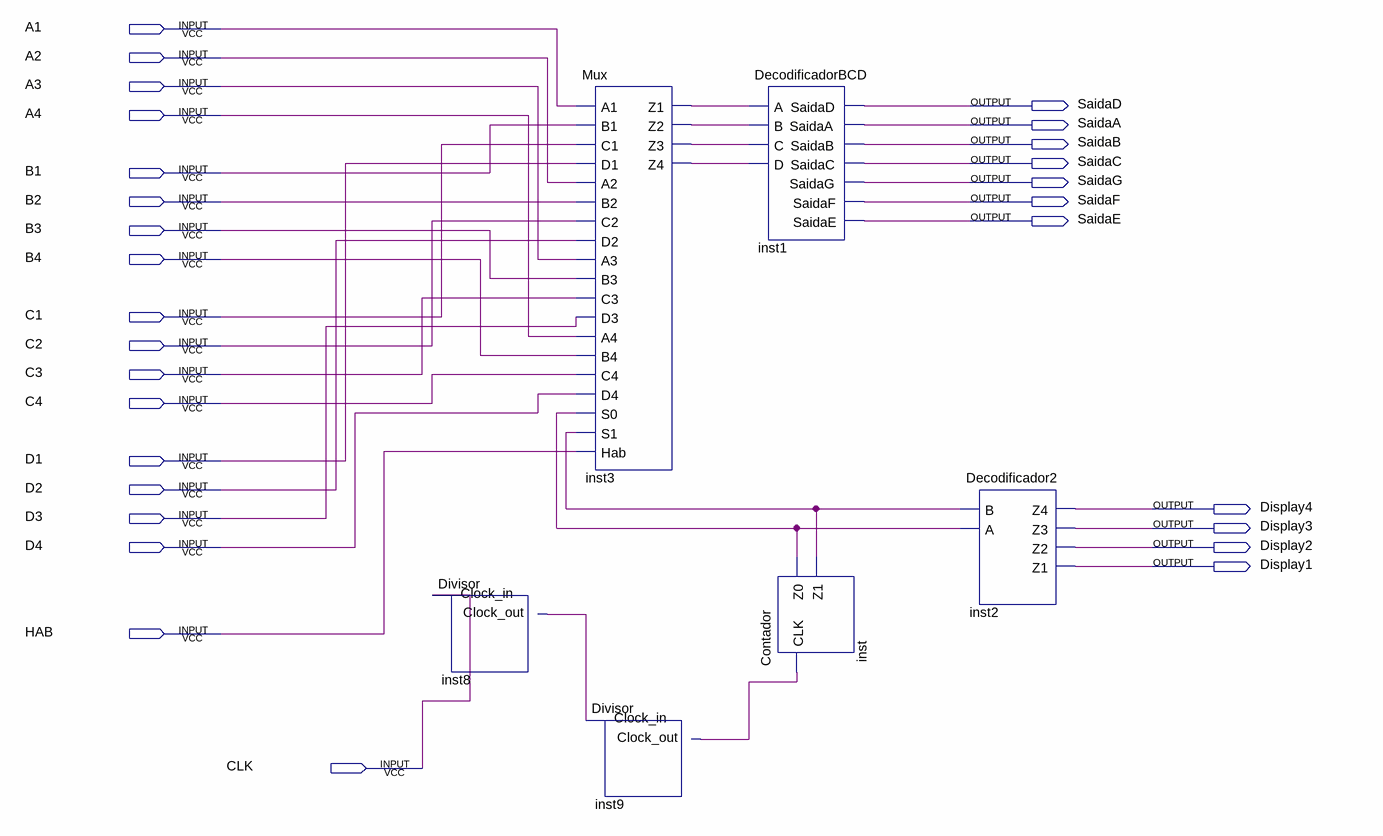
[diagram p0: schematic sheet]
// Quartus schematic PBL02.bdf as structural Verilog: 6 symbols, 29 pins
module PBL02 (
  input  A1,
  input  A2,
  input  A3,
  input  A4,
  input  B1,
  input  B2,
  input  B3,
  input  B4,
  input  C1,
  input  C2,
  input  C3,
  input  C4,
  input  D1,
  input  D2,
  input  D3,
  input  D4,
  input  HAB,
  input  CLK,
  output SaidaD,
  output SaidaA,
  output SaidaB,
  output SaidaC,
  output SaidaG,
  output SaidaF,
  output SaidaE,
  output Display4,
  output Display3,
  output Display2,
  output Display1
);

  wire inst3_z1, inst3_z2, inst3_z3, inst3_z4, inst8_clock_out, inst9_clock_out, inst_z0, inst_z1;

  Divisor inst8 (.Clock_in(CLK), .Clock_out(inst8_clock_out));
  Mux inst3 (
    .A1(A1), .B1(B1), .C1(C1), .D1(D1), .A2(A2), .B2(B2), .C2(C2), .D2(D2), .A3(A3), .B3(B3), .C3(C3),
    .D3(D3), .A4(A4), .B4(B4), .C4(C4), .D4(D4), .S0(inst_z0), .S1(inst_z1), .Hab(HAB), .Z1(inst3_z1),
    .Z2(inst3_z2), .Z3(inst3_z3), .Z4(inst3_z4));
  Divisor inst9 (.Clock_in(inst8_clock_out), .Clock_out(inst9_clock_out));
  DecodificadorBCD inst1 (
    .A(inst3_z1), .B(inst3_z2), .C(inst3_z3), .D(inst3_z4), .SaidaD(SaidaD), .SaidaA(SaidaA),
    .SaidaB(SaidaB), .SaidaC(SaidaC), .SaidaG(SaidaG), .SaidaF(SaidaF), .SaidaE(SaidaE));
  Contador inst (.CLK(inst9_clock_out), .Z0(inst_z0), .Z1(inst_z1));
  Decodificador2 inst2 (.B(inst_z1), .A(inst_z0), .Z4(Display4), .Z3(Display3), .Z2(Display2), .Z1(Display1));
endmodule
